# Altium schematic sheet SFP_Level_Translate.SchDoc
size A4; Author: Paweł Kulik; DrawnBy: Paweł Kulik; Organization: Warsaw University of Technology; Rule: PcbType=ProtelPcb
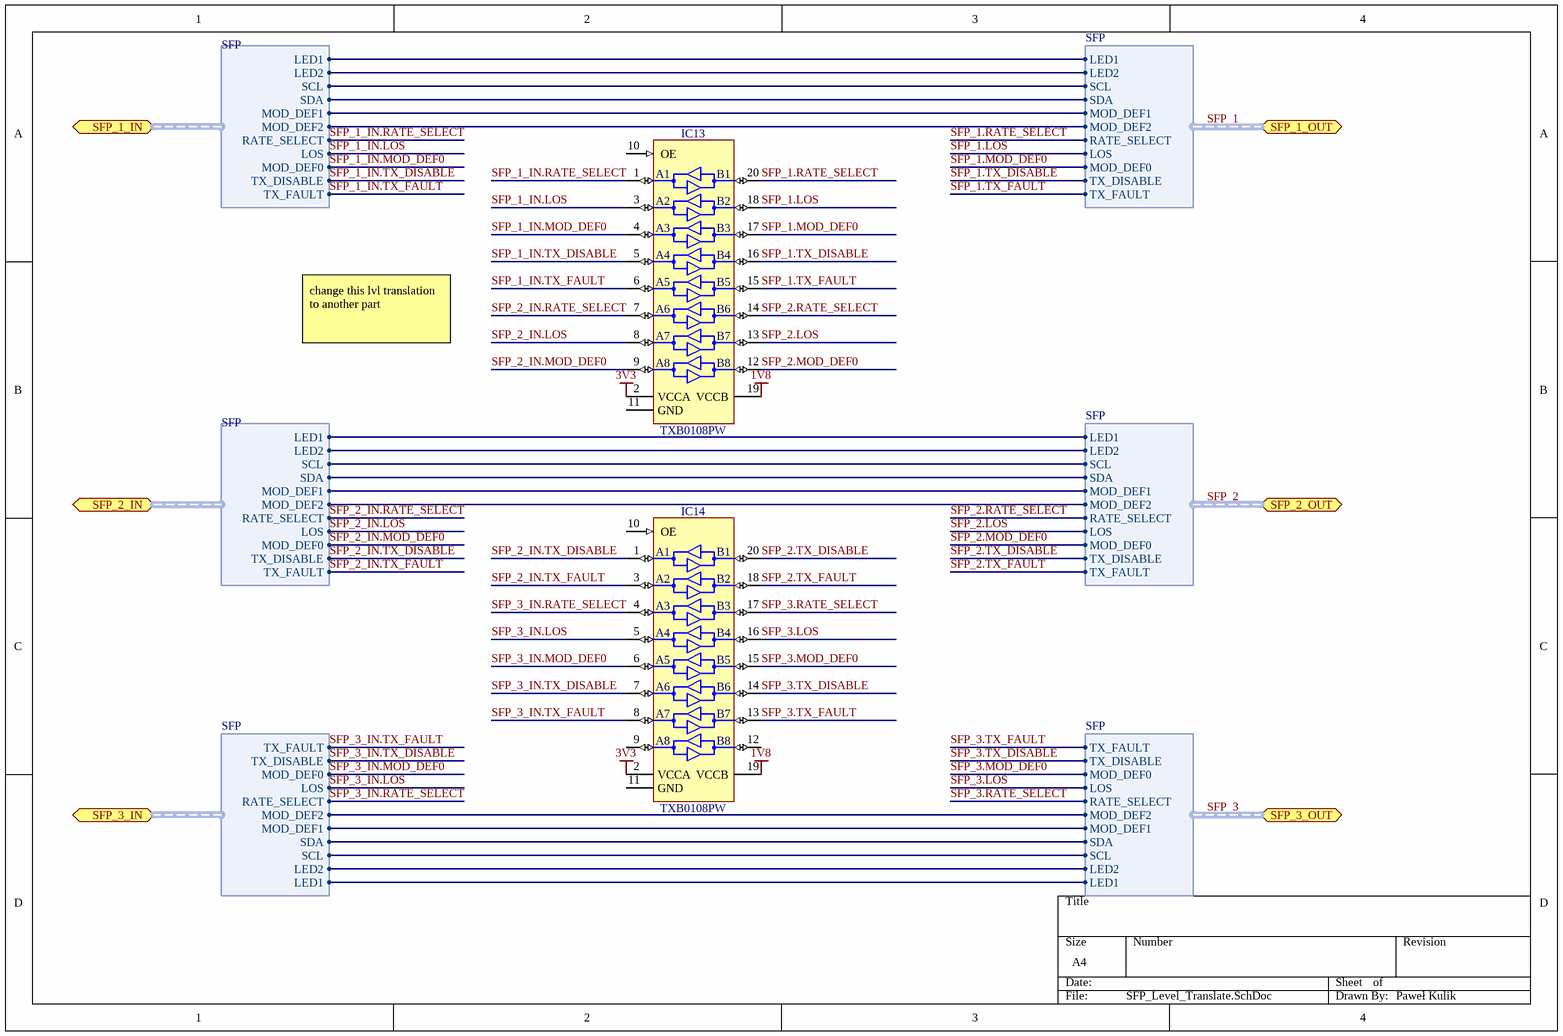
[diagram p0: SFP_Level_Translate.SchDoc]

## Parts
IC13  TXB0108PW  [SOP65P640X120-20N]
IC14  TXB0108PW  [SOP65P640X120-20N]

## Ports
SFP_1_IN (harness SFP), SFP_1_OUT (harness SFP), SFP_2_IN (harness SFP), SFP_2_OUT (harness SFP), SFP_3_IN (harness SFP), SFP_3_OUT (harness SFP)

## Harnesses
SFP: LED1, LED2, LOS, MOD_DEF0, MOD_DEF1, MOD_DEF2, RATE_SELECT, SCL, SDA, TX_DISABLE, TX_FAULT

## Nets
1V8: IC13.19(Vccb) IC14.19(Vccb)
3V3: IC13.2(Vcca) IC14.2(Vcca)
SFP_1.LED1: port SFP_1_IN.LED1, port SFP_1_OUT.LED1
SFP_1.LED2: port SFP_1_IN.LED2, port SFP_1_OUT.LED2
SFP_1.LOS: IC13.18(B2) ; port SFP_1_OUT.LOS
SFP_1.MOD_DEF0: IC13.17(B3) ; port SFP_1_OUT.MOD_DEF0
SFP_1.MOD_DEF1: port SFP_1_IN.MOD_DEF1, port SFP_1_OUT.MOD_DEF1
SFP_1.MOD_DEF2: port SFP_1_IN.MOD_DEF2, port SFP_1_OUT.MOD_DEF2
SFP_1.RATE_SELECT: IC13.20(B1) ; port SFP_1_OUT.RATE_SELECT
SFP_1.SCL: port SFP_1_IN.SCL, port SFP_1_OUT.SCL
SFP_1.SDA: port SFP_1_IN.SDA, port SFP_1_OUT.SDA
SFP_1.TX_DISABLE: IC13.16(B4) ; port SFP_1_OUT.TX_DISABLE
SFP_1.TX_FAULT: IC13.15(B5) ; port SFP_1_OUT.TX_FAULT
SFP_1_IN.LOS: IC13.3(A2) ; port SFP_1_IN.LOS
SFP_1_IN.MOD_DEF0: IC13.4(A3) ; port SFP_1_IN.MOD_DEF0
SFP_1_IN.RATE_SELECT: IC13.1(A1) ; port SFP_1_IN.RATE_SELECT
SFP_1_IN.TX_DISABLE: IC13.5(A4) ; port SFP_1_IN.TX_DISABLE
SFP_1_IN.TX_FAULT: IC13.6(A5) ; port SFP_1_IN.TX_FAULT
SFP_2.LED1: port SFP_2_IN.LED1, port SFP_2_OUT.LED1
SFP_2.LED2: port SFP_2_IN.LED2, port SFP_2_OUT.LED2
SFP_2.LOS: IC13.13(B7) ; port SFP_2_OUT.LOS
SFP_2.MOD_DEF0: IC13.12(B8) ; port SFP_2_OUT.MOD_DEF0
SFP_2.MOD_DEF1: port SFP_2_IN.MOD_DEF1, port SFP_2_OUT.MOD_DEF1
SFP_2.MOD_DEF2: port SFP_2_IN.MOD_DEF2, port SFP_2_OUT.MOD_DEF2
SFP_2.RATE_SELECT: IC13.14(B6) ; port SFP_2_OUT.RATE_SELECT
SFP_2.SCL: port SFP_2_IN.SCL, port SFP_2_OUT.SCL
SFP_2.SDA: port SFP_2_IN.SDA, port SFP_2_OUT.SDA
SFP_2.TX_DISABLE: IC14.20(B1) ; port SFP_2_OUT.TX_DISABLE
SFP_2.TX_FAULT: IC14.18(B2) ; port SFP_2_OUT.TX_FAULT
SFP_2_IN.LOS: IC13.8(A7) ; port SFP_2_IN.LOS
SFP_2_IN.MOD_DEF0: IC13.9(A8) ; port SFP_2_IN.MOD_DEF0
SFP_2_IN.RATE_SELECT: IC13.7(A6) ; port SFP_2_IN.RATE_SELECT
SFP_2_IN.TX_DISABLE: IC14.1(A1) ; port SFP_2_IN.TX_DISABLE
SFP_2_IN.TX_FAULT: IC14.3(A2) ; port SFP_2_IN.TX_FAULT
SFP_3.LED1: port SFP_3_IN.LED1, port SFP_3_OUT.LED1
SFP_3.LED2: port SFP_3_IN.LED2, port SFP_3_OUT.LED2
SFP_3.LOS: IC14.16(B4) ; port SFP_3_OUT.LOS
SFP_3.MOD_DEF0: IC14.15(B5) ; port SFP_3_OUT.MOD_DEF0
SFP_3.MOD_DEF1: port SFP_3_IN.MOD_DEF1, port SFP_3_OUT.MOD_DEF1
SFP_3.MOD_DEF2: port SFP_3_IN.MOD_DEF2, port SFP_3_OUT.MOD_DEF2
SFP_3.RATE_SELECT: IC14.17(B3) ; port SFP_3_OUT.RATE_SELECT
SFP_3.SCL: port SFP_3_IN.SCL, port SFP_3_OUT.SCL
SFP_3.SDA: port SFP_3_IN.SDA, port SFP_3_OUT.SDA
SFP_3.TX_DISABLE: IC14.14(B6) ; port SFP_3_OUT.TX_DISABLE
SFP_3.TX_FAULT: IC14.13(B7) ; port SFP_3_OUT.TX_FAULT
SFP_3_IN.LOS: IC14.5(A4) ; port SFP_3_IN.LOS
SFP_3_IN.MOD_DEF0: IC14.6(A5) ; port SFP_3_IN.MOD_DEF0
SFP_3_IN.RATE_SELECT: IC14.4(A3) ; port SFP_3_IN.RATE_SELECT
SFP_3_IN.TX_DISABLE: IC14.7(A6) ; port SFP_3_IN.TX_DISABLE
SFP_3_IN.TX_FAULT: IC14.8(A7) ; port SFP_3_IN.TX_FAULT

Not connected (* = marked no-connect by the designer): IC13 10(OE) 11(GND); IC14 9(A8) 10(OE) 11(GND) 12(B8)

## Buses and harness runs
harness SFP_1 = port SFP_1_OUT
harness SFP_2 = port SFP_2_OUT
harness SFP_3 = port SFP_3_OUT

## Notes on the sheet
- change this lvl translation to another part
- (in symbol TXB0108PW) VCCA; VCCB

## Library data of the parts
IC13 IC14 = TXB0108PW: 8-Bit Bidirectional Voltage-Level Translator with Automatic Direction Sensing and ±15kV ESD Protection; Manufacturer: TEXAS INSTRUMENTS; PressFit: No; Bonding: No; Part Number: TXB0108PW; Component Kind: Standard; Component Type: Standard; Device: TXB0108PW; PackageDescription: SOP, 20-Leads, Body 6.5x4.4mm, Pitch 0.65mm, IPC Medium Density; Part Description: 8-Bit Bidirectional Voltage-Level Translator with Automatic Direction Sensing and ±15kV ESD Protection; Manufacturer Part Number: TXB0108PW; Pin Count: 20; Case: TSSOP20; Mounted: Yes; Socket: No; SMD: Yes; Sense: No; ComponentHeight: 1.2mm; Author: CERN DEM MR; HelpURL: \\cern.ch\dfs\Applications\Altium\Datasheets\TXB0108PW.pdf; CreateDate: 2016-04-01; LatestRevisionDate: 2016-04-01